# Altium schematic sheet UART_MUX.SchDoc
size A3; DocumentNumber: 4; SheetNumber: 4; SheetTotal: 5
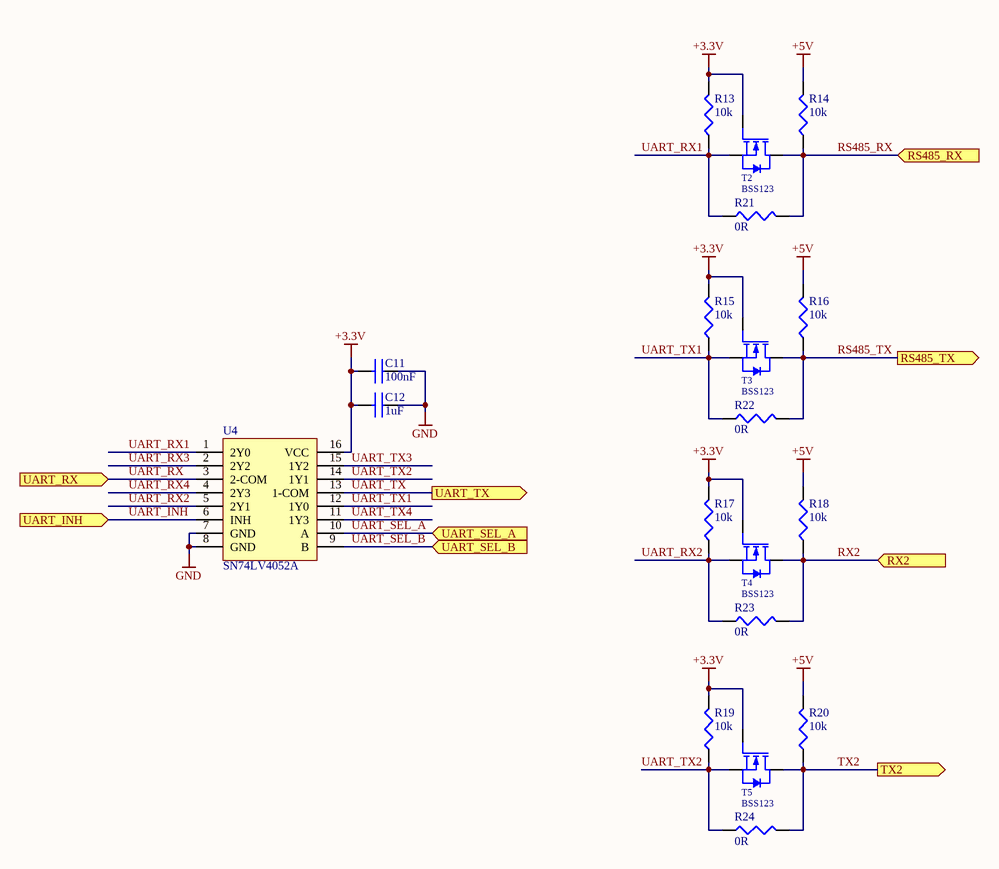
[diagram p0: UART_MUX.SchDoc]

## Parts
C11  100nF  [CAP0603]
C12  1uF  [CAP0603]
R13  10k  [RES0603]
R14  10k  [RES0603]
R15  10k  [RES0603]
R16  10k  [RES0603]
R17  10k  [RES0603]
R18  10k  [RES0603]
R19  10k  [RES0603]
R20  10k  [RES0603]
R21  0R  [RES0603]
R22  0R  [RES0603]
R23  0R  [RES0603]
R24  0R  [RES0603]
T2  BSS123  [SOT23-3AL]
T3  BSS123  [SOT23-3AL]
T4  BSS123  [SOT23-3AL]
T5  BSS123  [SOT23-3AL]
U4  SN74LV4052A  [SOIC-16]

## Ports
RS485_RX (in), RS485_TX (out), RX2 (in), TX2 (out), UART_INH (in), UART_RX (in), UART_SEL_A (in), UART_SEL_B (in), UART_TX (out)

## Nets
+3.3V: C11.2 C12.2 R13.2 R15.2 R17.2 R19.2 T2.1(G) T3.1(G) T4.1(G) T5.1(G) U4.16(VCC)
+5V: R14.2 R16.2 R18.2 R20.2
GND: C11.1 C12.1 U4.7(GND) U4.8(GND)
RS485_RX: R14.1 R21.2 T2.3(D) ; port RS485_RX
RS485_TX: R16.1 R22.2 T3.3(D) ; port RS485_TX
RX2: R18.1 R23.2 T4.3(D) ; port RX2
TX2: R20.1 R24.2 T5.3(D) ; port TX2
UART_INH: U4.6(INH) ; port UART_INH
UART_RX: U4.3(2-COM) ; port UART_RX
UART_RX1: R13.1 R21.1 T2.2(S) U4.1(2Y0)
UART_RX2: R17.1 R23.1 T4.2(S) U4.5(2Y1)
UART_RX3: U4.2(2Y2)
UART_RX4: U4.4(2Y3)
UART_SEL_A: U4.10(A) ; port UART_SEL_A
UART_SEL_B: U4.9(B) ; port UART_SEL_B
UART_TX: U4.13(1-COM) ; port UART_TX
UART_TX1: R15.1 R22.1 T3.2(S) U4.12(1Y0)
UART_TX2: R19.1 R24.1 T5.2(S) U4.14(1Y1)
UART_TX3: U4.15(1Y2)
UART_TX4: U4.11(1Y3)

## Notes on the sheet
- Size: A3
- Revision:
- Sheet
- of

## Library data of the parts
C11 = C - 100nF: MURATA - GRM188R71C104KA01J - CAP, MLCC, X7R, 0.1UF, 16V, 0603; IRNAS Part No.: I-200005; Ceramic Capacitor Case: 0603 [1608 Metric]; Capacitance: 0.1; Voltage Rating: 16; Capacitance Tolerance: ± 10%; Dielectric Characteristic: X7; Product Range: GRM Series; SVHC: No SVHC (20-Jun-2016; Supplier 1: Farnell; Manufacturer: MURATA; Manufacturer Part Number: GRM188R71C104KA01J; RoHS: YES; Stock 1: 18297; Pricing 1: 10=0.0145, 100=0.0126, 500=0.0081, 2500=0.0059, 5000=0.0052, 10000=0.0046, 50000=0.0036, 100000=0.0035 (GBP); Packaging: Cut Tape; Operating Temperature Min: -55; Operating Temperature Max: 125; Automotive Qualification Standard: -; MSL: MSL 1 - Unlimited; ComponentLink1URL: http://www.farnell.com/datasheets/2189124.pdf; ComponentLink1Description: http://www.farnell.com/datasheets/2189124.pdf; Supplier Part Number 1: 2688519
C12 = C - 1uF: MURATA - GRM188R61H105KAALD - CAP, MLCC, X5R, 1UF, 50V, 0603; IRNAS Part No.: I-200006; Ceramic Capacitor Case: 0603 [1608 Metric]; Capacitance: 1; Voltage Rating: 50; Capacitance Tolerance: ± 10%; Dielectric Characteristic: X5; Product Range: GRM Series; SVHC: No SVHC (17-Dec-2015); Capacitor Terminals: SMD<!--FANDB--><div class="features-and-benefits-container"><div class="features-and-benefits-description"><span class="features-benefits-value">The Murata GRM series capacitors are Multilayer Ceramic Chip Capacitors (MLCC) used for general purpose applications. These MLCC capacitors are classified into temperature compensating and high dielectric constant types depending on the change in electrostatic capacitance due to change in temperature. The temperature compensating capacitors feature a small rate of change in electrostatic capacitance as the temperature changes and are used for applications such as filters and high frequency circuit matching. The high dielectric constant capacitors use materials with a high dielectric constant and feature a large electrostatic capacitance. Typical applications are power supply decoupling and smoothing circuits.</span></div><div class="features-and-benefits-list"><ul class="features-and-benefits-list-list"><li class="features-and-benefits-list-item">Large capacity and small size in a multilayer structure</li><li class="features-and-benefits-list-item">Capacitance value ranging from 0.1pF to 220?F</li><li class="features-and-benefits-list-item">Tin plated external electrodes, excellent solderability</li><li class="features-and-benefits-list-item">Provides good high frequency characteristics</li><li class="features-and-benefits-list-item">Excellent pulse response</li><li class="features-and-benefits-list-item">High reliability</li><li class="features-and-benefits-list-item">Capacitor size varies from 0.4×0.2mm to 5.7×5.0mm</li><li class="features-and-benefits-list-item">Rated voltage of 2.5VDC to 3.15; Supplier 1: Farnell; Manufacturer: MURATA; Manufacturer Part Number: GRM188R61H105KAALD; RoHS: YES; Stock 1: 62682; Pricing 1: 10=0.093, 100=0.062, 500=0.0507, 1000=0.0465, 2000=0.0429, 4000=0.0399, 20000=0.0372, 40000=0.0365 (GBP); Packaging: Cut Tape; Operating Temperature Min: -55; Operating Temperature Max: 85; Automotive Qualification Standard: -; MSL: -; Capacitance Tolerance ±: ± 10%; ComponentLink1URL: http://www.farnell.com/datasheets/2048611.pdf; ComponentLink1Description: http://www.farnell.com/datasheets/2048611.pdf; Supplier Part Number 1: 1845736
R13-R20 = R - 10k: MULTICOMP - MCMR06X103 JTL - RES, CERAMIC, 10K, 5%, 0.1W, 0603; IRNAS Part No.: I-100008; Resistance: 10; Voltage Rating: 75; Resistor Case Style: 0603 [1608 Metric]; Power Rating: 100; Product Range: MCMR Series; Temperature Coefficient: ± 100; Automotive Qualification Standard: -<!--FANDB--><div class="features-and-benefits-container"><div class="features-and-benefits-description"><span class="features-benefits-value">The Multicomp MCMR series resistors are automotive grade, anti sulphured thick film chip resistor. The resistance range includes E24 and E96 decade values from 1ohm to 10Mohm. These resistors are constructed on top of a high grade ceramic body.</span></div><div class="features-and-benefits-list"><ul class="features-and-benefits-list-list"><li class="features-and-benefits-list-item">EIA 0402, 0603, 0805, 1206 chip sizes available</li><li class="features-and-benefits-list-item">High reliability and stability</li><li class="features-and-benefits-list-item">Automotive grade AEC-Q200 compliant</li><li class="features-and-benefits-list-item">Complaint with (IEC 60068-1) 55/155/56 climatic category</li><li class="features-and-benefits-list-item">Maximum operation voltage of 50V, 75V, 150V and 200V</li><li class="features-and-benefits-list-item">Power rating of 62.5mW, 100mW, 125mW and 250mW</li><li class="features-and-benefits-list-item">Available in ±1% and ±5% tolerance</li><li class="features-and-benefits-list-item">Temperature coefficient (TCR) of +200ppm/°C, +100ppm/°C and -200ppm/°C to +400ppm/°C</li><li class="features-and-benefits-list-item">Operating temperature range -55°C to 155; Supplier 1: Farnell; Manufacturer: MULTICOMP; Manufacturer Part Number: MCMR06X103 JTL; RoHS: Y-EX; Stock 1: 19791; Pricing 1: 10=0.0087, 100=0.0074, 500=0.0061, 1000=0.0048, 2500=0.0032, 5000=0.0024, 25000=0.0016, 50000=0.0013 (GBP); Resistance Tolerance: ± 5%; Packaging: Cut Tape; Resistor Element Material: Ceramic; ComponentLink1URL: http://www.farnell.com/datasheets/1716707.pdf; ComponentLink1Description: http://www.farnell.com/datasheets/1716707.pdf; Supplier Part Number 1: 2073356
R21-R24 = R - 0R: BOURNS - CR0603-J/-000ELF - RES, THICK FILM, 0R, 5%, 0.1W, 0603; IRNAS Part No.: I-100011; Resistance: 0; Voltage Rating: 50; Resistor Case Style: 0603 [1608 Metric]; Power Rating: 100; Product Range: CR Series; SVHC: No SVHC (17-Dec-2015); Resistor Mounting: Surface Mount Device<!--FANDB--><div class="features-and-benefits-container"><div class="features-and-benefits-description"><span class="features-benefits-value">The Bourns CR series are standard thick film chip resistors. These resistors provide flexibility of performance, space saving and low cost. The Resistance range includes E96 and E24 decade values from 1ohm to 10Mohm.</span></div><div class="features-and-benefits-list"><ul class="features-and-benefits-list-list"><li class="features-and-benefits-list-item">0201, 0402, 0603, 0805, 1206, 1210, 2010, 2512 standard case sizes available</li><li class="features-and-benefits-list-item">±1% and ±5% tolerance</li><li class="features-and-benefits-list-item">±100ppm/°C, ±200ppm/°C and ±250ppm/°C TCR values available</li><li class="features-and-benefits-list-item">Power rating selectable for 50mW, 63mW, 0.1W, 0.125W, 0.25W, 0.5W and 1W based on ordering</li><li class="features-and-benefits-list-item">Jumpers are available for all size</li><li class="features-and-benefits-list-item">3 layer termination process with nickel barrier prevents leaching & provides excellent solderability</li><li class="features-and-benefits-list-item">Suitable for all type of soldering processes</li><li class="features-and-benefits-list-item">Tight dimensional tolerances</li><li class="features-and-benefits-list-item">Maximum working voltage depends on case size</li><li class="features-and-benefits-list-item">Operating temperature of -55°C to +125°C(CR0201) and -55°C to +155; Supplier 1: Farnell; Manufacturer: BOURNS; Manufacturer Part Number: CR0603-J/-000ELF; RoHS: YES; Stock 1: 58200; Pricing 1: 10=0.0146, 250=0.0097, 1000=0.0073, 5000=0.0049, 12500=0.0042 (GBP); Resistance Tolerance: ± 5%; Packaging: Cut Tape; Resistor Element Material: Thick Film; Temperature Coefficient: -; Automotive Qualification Standard: -; MSL: MSL 1 - Unlimited; ComponentLink1URL: http://www.bourns.com/engineering/CHPREZTR/cr0603.stp; ComponentLink1Description: http://www.bourns.com/engineering/CHPREZTR/cr0603.stp; ComponentLink2URL: http://www.farnell.com/datasheets/2178762.pdf; ComponentLink2Description: http://www.farnell.com/datasheets/2178762.pdf; Supplier Part Number 1: 2008343
T2-T5 = T_M - BSS123: N-Channel Vds = 100V, Id = 170 mA; Opis / Description: MOSFET BSS123       /N-Channel; Komp / Device: SMD; Value: BSS128W; Velikost / Size: SOT23; ComponentLink1Description: Datasheet; ComponentLink1URL: C:\ELRADSVN\Altium_Library\Libraries\Active\Datasheet\BSS138BKW.pdf; Date: 11.07.2018; Supplier 1: Farnell; Supplier Part Number 1: 9845321
U4 = INT - SN74LV4052A: Analog Multiplexer/Demultiplexer, 4:1, 2 Circuits, 100ohm, 2V to 5.5V Supply, SOIC-16; Supplier 1: Farnell; Supplier Part Number 1: 2854627